# Altium schematic sheet POWER CONTROL.SchDoc: =project_title
size Tabloid; CompanyName: Luxonis Holding; Organization: Luxonis Holding; Address1: 1925 Harmony Park Drive; Address2: Westminster, CO; Address3: 80234; Address4: United States; SheetNumber: 4; SheetTotal: 8
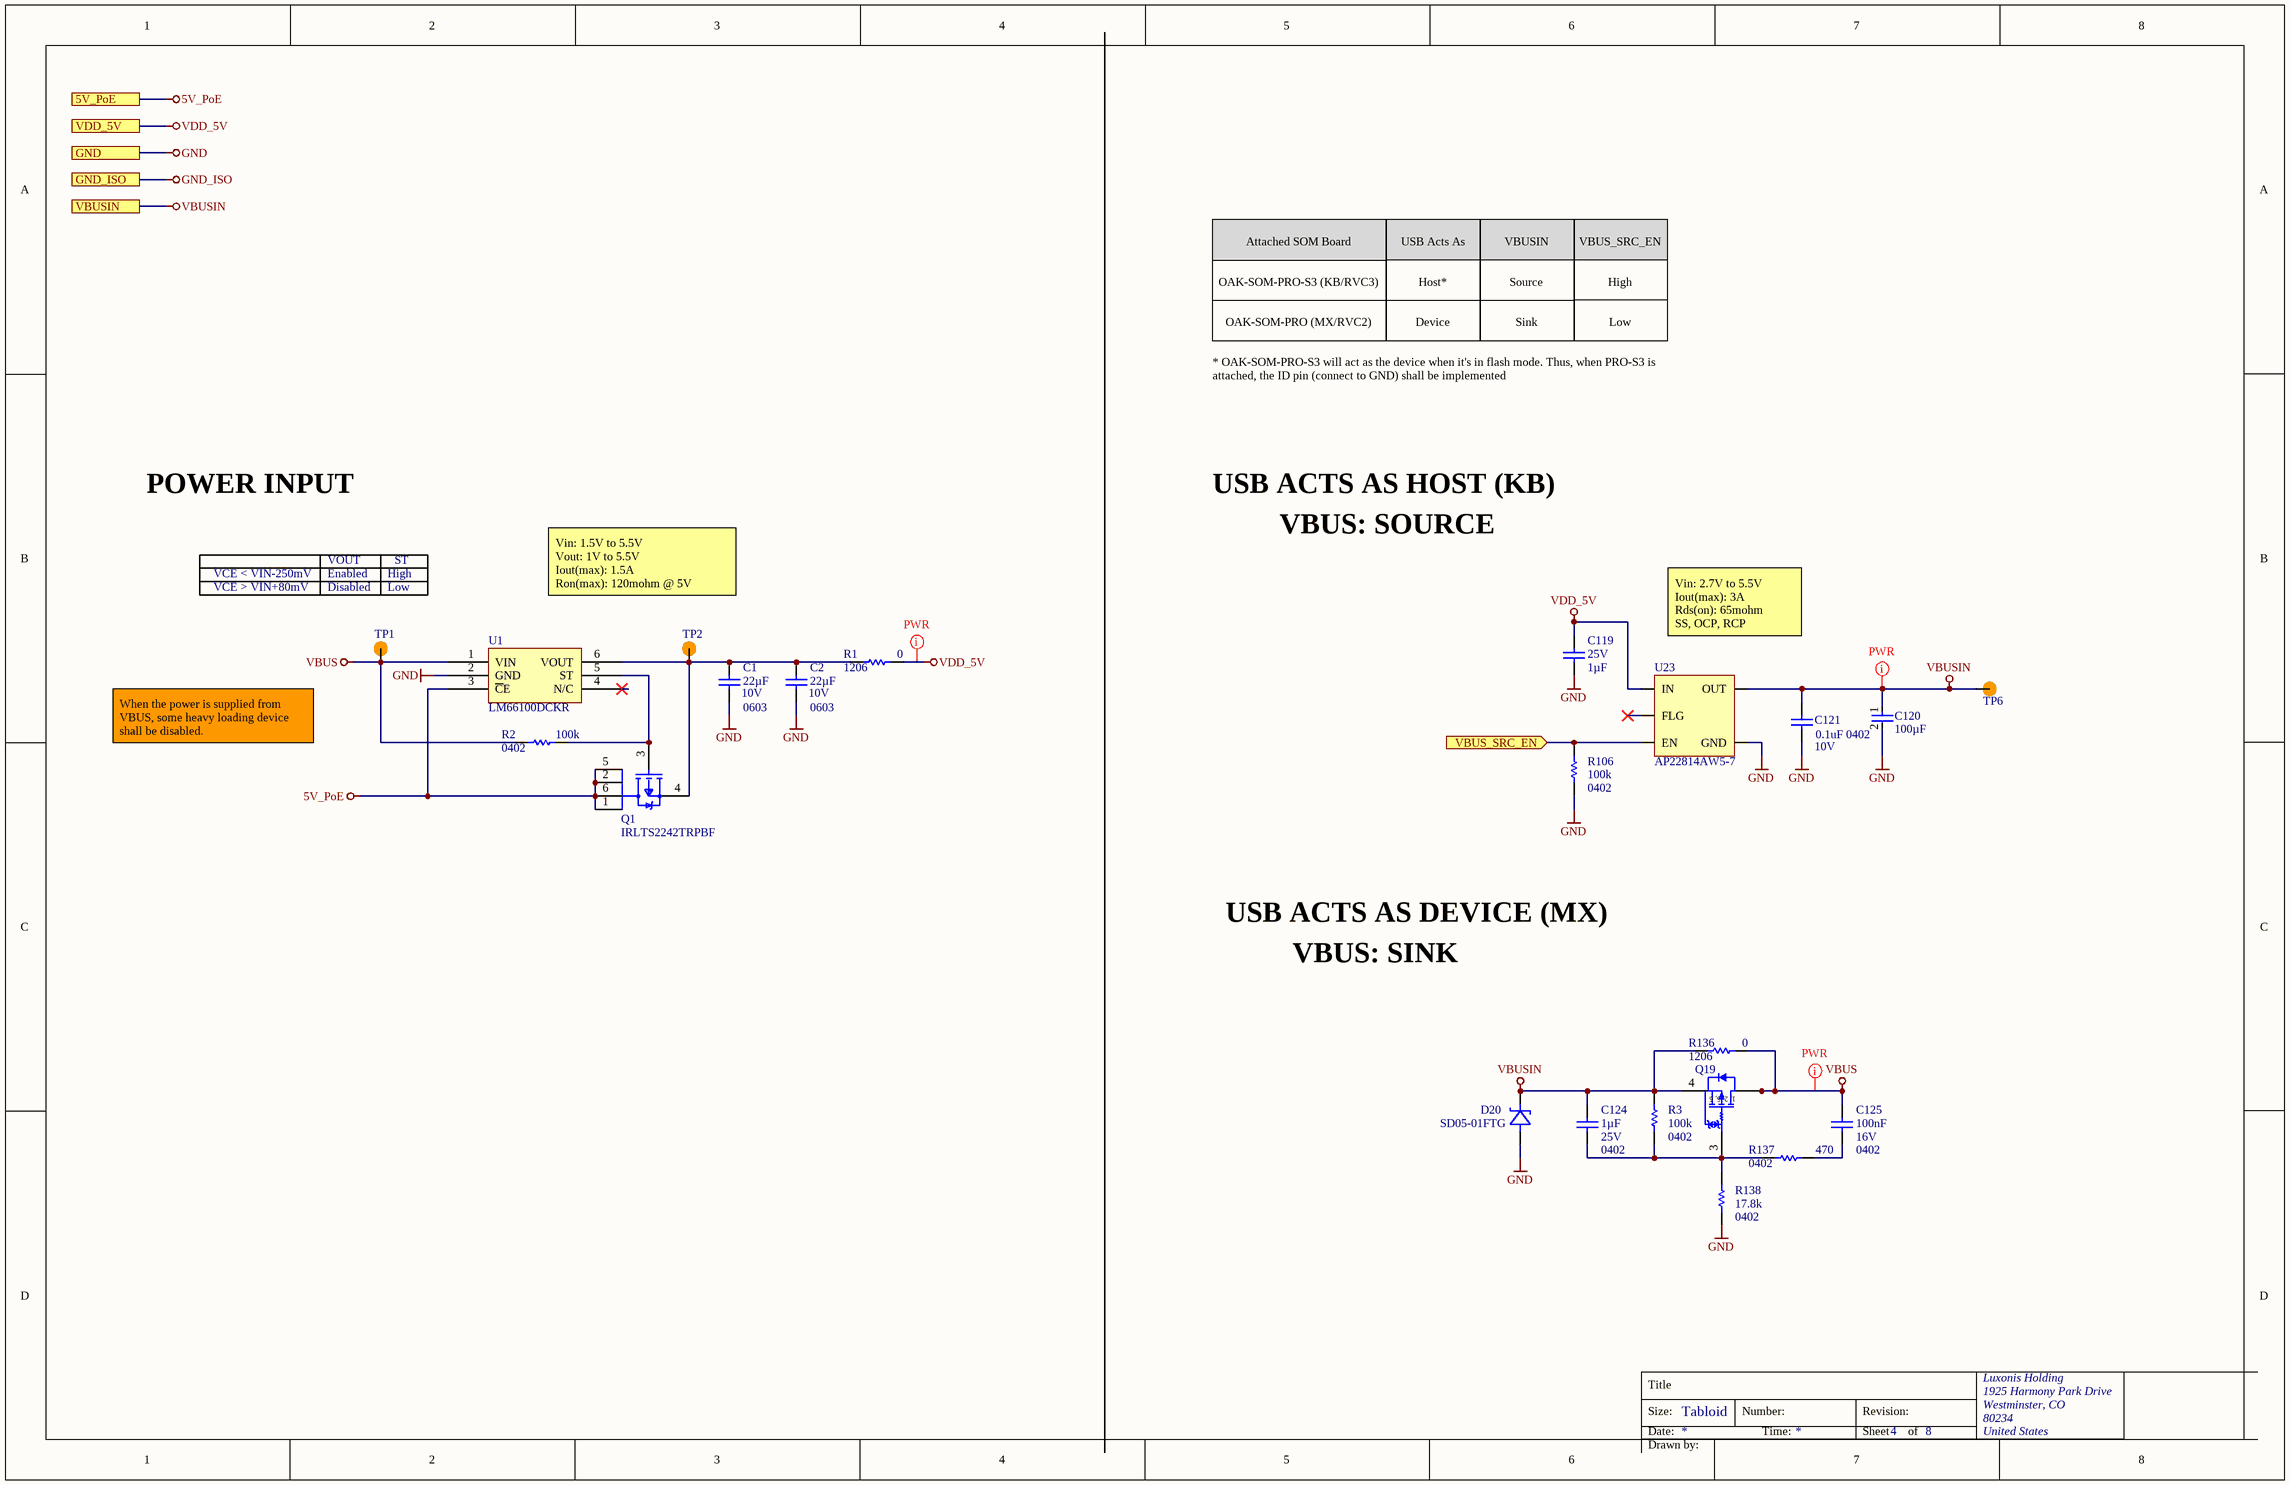
[diagram p0: POWER CONTROL.SchDoc]

## Parts
C1  value 22µF  Voltage Rating: 10V  Case/Package: 0603  [CAPC0603(1608)100_N]  (hidden comment: GRM188R61A226ME15D)
C2  value 22µF  Voltage Rating: 10V  Case/Package: 0603  [CAPC0603(1608)100_N]  (hidden comment: GRM188R61A226ME15D)
C119  value 1µF  Voltage Rating: 25V  [CAPC0402(1005)70_N]  (hidden comment: GRM155R61E105KA12D)
C120  value 100µF  [FP-C1210C107M8PACTU-MFG]  (hidden comment: C1210C107M8PACTU)
C121  0.1uF 0402  Voltage Rating: 10V  [CAPC0402(1005)70_N]
C124  value 1µF  Voltage Rating: 25V  Case/Package: 0402  [CAPC0402(1005)70_N]  (hidden comment: GRM155R61E105KA12D)
C125  value 100nF  Voltage Rating: 16V  Case/Package: 0402  [CAPC0402(1005)60_N]  (hidden comment: CL05B104KO5NFNC)
D20  SD05-01FTG  [SD05-01FTG-Footprint-1]
Q1  IRLTS2242TRPBF  [TSOP-6-MFG]
Q19  NTJS4151PT1G  [ONSC-SC70-6-419B-02_W_V]  (value not drawn)
R1  value 0  Case/Package: 1206  [RESC3116X70X50ML13T20]  (hidden comment: ERJ8GEY0R00V)
R2  value 100k  Case/Package: 0402  [RESC0402(1005)_L]  (hidden comment: RC0402FR-07100KL)
R3  value 100k  Case/Package: 0402  [RESC0402(1005)_L]  (hidden comment: RC0402FR-07100KL)
R106  value 100k  Case/Package: 0402  [RESC0402(1005)_L]  (hidden comment: RC0402FR-07100KL)
R136  value 0  Case/Package: 1206  [RESC3116X70X50ML13T20]  (hidden comment: ERJ8GEY0R00V)
R137  value 470  Case/Package: 0402  [RESC0402(1005)_L]  (hidden comment: CRCW0402470RFKED)
R138  value 17.8k  Case/Package: 0402  [RESC0402(1005)_L]  (hidden comment: ERJ-2RKF1782X)
TP1  TP100_200_NS  [TP075_150_NS]  (value not drawn)  (no BOM)
TP2  TP100_200_NS  [TP075_150_NS]  (value not drawn)  (no BOM)
TP6  TP100_200_NS  [TP075_150_NS]  (value not drawn)  (no BOM)
U1  LM66100DCKR  [LM66100DCKR]
U23  AP22814AW5-7  [AP22814AW5-7-Footprint-1]

## Ports
5V_PoE, GND, GND_ISO, VBUS_SRC_EN (in), VBUSIN, VDD_5V

## Nets
5V_PoE: Q1.1(D) Q1.2(D) Q1.5(D) Q1.6(D) U1.3(~{C}E) ; port 5V_PoE
GND: C1.1 C2.1 C119.1 C120.2 C121.1 D20.1 R106.2 R138.1 U1.2(GND) U23.2(GND) ; port GND
GND_ISO: port GND_ISO
VBUS: C125.2 Q19.1(D) Q19.2(D) Q19.5(D) Q19.6(D) R2.2 R136.2 TP1.1 U1.1(VIN)
VBUSIN: C120.1 C121.2 C124.2 D20.2 Q19.4(S) R3.2 R136.1 TP6.1 U23.1(OUT) ; port VBUSIN
VDD_5V: C119.2 R1.2 U23.5(IN) ; port VDD_5V
VBUS_SRC_EN: R106.1 U23.4(EN) ; port VBUS_SRC_EN
NetC1_2: C1.2 C2.2 Q1.4(S) R1.1 TP2.1 U1.6(VOUT)
NetC124_1: C124.1 Q19.3(G) R3.1 R137.1 R138.2
NetC125_1: C125.1 R137.2
NetQ1_3: Q1.3(G) R2.1 U1.5(ST)

Not connected (* = marked no-connect by the designer): U1 4(N/C)*; U23 3(FLG)*

## Layout directives
net class PWR; Current Rating: 1.5A: VBUS, VBUSIN
net class PWR; Current Rating: 3A: VDD_5V

## Notes on the sheet
- OAK-SOM-PRO-S3 (KB/RVC3)
- Attached SOM Board
- USB Acts As
- Host*
- VBUSIN
- Source
- VBUS_SRC_EN
- High
- OAK-SOM-PRO (MX/RVC2)
- Device
- Sink
- Low
- * OAK-SOM-PRO-S3 will act as the device when it's in flash mode. Thus, when PRO-S3 is attached, the ID pin (connect to GND) shall be implemented
- POWER INPUT
- USB ACTS AS HOST (KB)
- VOUT
- ST
- VBUS: SOURCE
- VCE < VIN-250mV
- VCE > VIN+80mV
- Enabled
- Disabled
- Vin: 1.5V to 5.5V
  Vout: 1V to 5.5V
  Iout(max): 1.5A
  Ron(max): 120mohm @ 5V
- Vin: 2.7V to 5.5V
  Iout(max): 3A
  Rds(on): 65mohm
  SS, OCP, RCP
- When the power is supplied from VBUS, some heavy loading device shall be disabled.
- USB ACTS AS DEVICE (MX)
- VBUS: SINK
- Title
- Size:
- Date:
- Tabloid
- Number:
- Time:
- Revision:
- Sheet
- of
- Drawn by:
- (in symbol CMP-061-000004-2) 1, 2, 5, 6

## Library data of the parts
C1 C2 = CMP-108-000020-4: CAP CER 22UF 10V X5R 0603 20%; Manufacturer 1: Murata; Tolerance: 20%; Max Operating Temperature: 85°C; ComponentLink1Description: https://datasheet.ciiva.com/46444/1769893-46444975.pdf?src-supplier=Element14; Min Operating Temperature: -55°C; Manufacturer Part Number 1: GRM188R61A226ME15D; Mounting Technology: SMT; Depth: 0.8mm; Design Item ID: GRM188R61A226ME15D; Height: 0.8mm; Dielectric: X5R; Width: 0.8mm; Length: 1.6mm; ComponentLink1URL: https://datasheet.ciiva.com/46444/1769893-46444975.pdf?src-supplier=Element14
C119 C124 = CMP-108-000014-5: CAP CER 1UF 25V X5R 0402 10%; Manufacturer 1: Murata; ComponentLink2Description: https://datasheet.ciiva.com/7719/1666664-7719006.pdf?src-supplier=Element14; ComponentLink2URL: https://datasheet.ciiva.com/7719/1666664-7719006.pdf?src-supplier=Element14; Max Operating Temperature: 85°C; Depth: 0.5mm; Mounting Technology: SMT; ComponentLink1URL: https://datasheet.ciiva.com/22732/1666664-22732122.pdf?src-supplier=Element14; Length: 1mm; ComponentLink1Description: https://datasheet.ciiva.com/22732/1666664-22732122.pdf?src-supplier=Element14; Manufacturer Part Number 1: GRM155R61E105KA12D; Tolerance: 10%; Design Item ID: GRM155R61E105KA12D; Dielectric: X5R; Min Operating Temperature: -55°C; Height: 0.5mm; Width: 0.5mm
  C119: Case/Package: 0402
C120 = CMP-001-00121-3: CAP CER 100UF 10V X5R 1210 20%; Manufacturer 1: Kemet; Capacitor Type: Ceramic; Manufacturer Part Number 1: C1210C107M8PACTU; Mounting Technology: SMT; Dielectric: X5R; Tolerance: 20%; Min Operating Temperature: -55°C; Case/Package: 1210; Voltage Rating: 10V; Max Operating Temperature: 85°C
C121 = GRM155R71A104JA01D: CAP CER 0.1UF 10V X7R 0402 5%; Manufacturer 1: Murata; Capacitance: 100nF; Supplier 1: Digi-Key; Manufacturer Part Number 1: GRM155R71A104JA01D; Stock 1: 1346709; Pricing 1: 1=0.10000, 10=0.02500, 100=0.01130, 500=0.00806, 1000=0.00633, 2500=0.00575, 5000=0.00529 (USD); RoHS: Yes; Mount: Surface Mount; Case/Package: 0402; Case Code (Imperial): 0402; Case Code (Metric): 1005; Min Operating Temperature: -55°C; Max Operating Temperature: 125°C; Tolerance: 5%; Packaging: Tape and Reel; Voltage Rating (DC): 10V; Dielectric: X7R; Package Quantity: 10000; Termination: SMD/SMT; Length: 1mm; Height: 0.5mm; Width: 0.02inch; Thickness: 0.022inch; Depth: 0.5mm; Radiation Hardening: No; Lead Free: Lead Free; ComponentLink1URL: https://datasheet.ciiva.com/5411/product-5411135.pdf?src-supplier=Mouser; ComponentLink1Description: https://datasheet.ciiva.com/5411/product-5411135.pdf?src-supplier=Mouser; ComponentLink2URL: https://datasheet.ciiva.com/11618/c02e-11618821.pdf?src-supplier=Avnet; ComponentLink2Description: https://datasheet.ciiva.com/11618/c02e-11618821.pdf?src-supplier=Avnet; Supplier Part Number 1: 490-10777-1-ND
C125 = CMP-108-000002-6: CAP CER 0.1UF 16V X7R 0402 10%; Manufacturer 1: Samsung; ComponentLink1URL: https://datasheet.ciiva.com/25767/cl05b104ko5nfnc-25767124.pdf?src-supplier=Digi-Key; Length: 1mm; Design Item ID: CL05B104KO5NFNC; Tolerance: 10%; Min Operating Temperature: -55°C; Width: 0.02inch; Dielectric: X7R; ComponentLink1Description: https://datasheet.ciiva.com/25767/cl05b104ko5nfnc-25767124.pdf?src-supplier=Digi-Key; Height: 0.5mm; Depth: 0.5mm; Manufacturer Part Number 1: CL05B104KO5NFNC; Max Operating Temperature: 125°C; Mounting Technology: SMT
D20 = CMP-004-00064-2: Trans Voltage Suppressor Diode, 450W, 5V V(RWM), Unidirectional, 1 Element; Manufacturer 1: Littelfuse; Manufacturer Part Number 1: SD05-01FTG; VBR: 5V
Q1 = CMP-016-000020-2: MOSFET P-CH 20V 6.9A 6TSOP; Manufacturer 1: Infineon; Max Drain to Source Voltage: -20V; Case/Package: TSOP; Manufacturer Part Number 1: IRLTS2242TRPBF; Design Item ID: IRLTS2242TRPBF; Continuous Drain Current: 6.9A
Q19 = CMP-061-000004-2: Trench Power MOSFET, -20 V, -4.2 A, Single P-Channel, 6-Pin SC70, Pb-Free, Tape and Reel; Manufacturer 1: ON Semiconductor; PD Max (W): 1; Continuous Drain Current: 4.2A; Transistor Type: P Channel; Mounting Technology: Surface Mount; PartNumber: NTJS4151PT1G; Manufacturer Part Number 1: NTJS4151PT1G; Design Item ID: NTJS4151PT1G
R1 R136 = CMP-009-00008-13: RES SMD 0 OHM 5% 0.25W 1206; Manufacturer 1: Panasonic; Power Rating: 250mW; Voltage Rating: 200V; Manufacturer Part Number 1: ERJ8GEY0R00V; Max Operating Temperature: 155°C; Tolerance: 5%; Min Operating Temperature: -55°C
R2 R3 R106 = CMP-013-000035-8: RES SMD 100K OHM 1% 1/16W 0402; Manufacturer 1: Yageo; Power Rating: 63mW; Voltage Rating: 50V; Design Item ID: RC0402FR-07100KL; Max Operating Temperature: 155°C; Min Operating Temperature: -55°C; Tolerance: 1%; Manufacturer Part Number 1: RC0402FR-07100KL
R137 = CMP-013-000029-9: RES SMD 470 OHM 1% 1/16W 0402; Manufacturer 1: Vishay; Voltage Rating: 50V; Power Rating: 63mW; Max Operating Temperature: 155°C; Min Operating Temperature: -55°C; Tolerance: 1%; Design Item ID: CRCW0402470RFKED; Manufacturer Part Number 1: CRCW0402470RFKED
R138 = CMP-013-000001-9: RES SMD 17.8K OHM 1% 1/10W 0402; Manufacturer 1: Panasonic; Power Rating: 100mW; Voltage Rating: 50V; Design Item ID: ERJ-2RKF1782X; Tolerance: 1%; Max Operating Temperature: 155°C; Manufacturer Part Number 1: ERJ-2RKF1782X; Min Operating Temperature: -55°C
TP1 TP2 TP6 = CMP-015-000000-2: Manufacturer Part Number 1: /; Source: LuxonisMaster.SchLib; Design Item ID: TEST_POINT
U1 = CMP-099-000001-2: IC OR CTRLR IDEAL DIODE SC70-6; Manufacturer 1: Texas Instruments; Manufacturer Part Number 1: LM66100DCKR
U23 = CMP-019-00050-2: Single Channel Power Distribution Load Switch, -40 to 85°C, Rohs; Manufacturer 1: Diodes Incorporated; Vfb/Vout: 0V; Max Output Current: 0A; Manufacturer Part Number 1: AP22814AW5-7; Case/Package: SOT-25